# EAGLE schematic MA-DAQ (EAGLE 5.11)

## Sheet 1 of 5
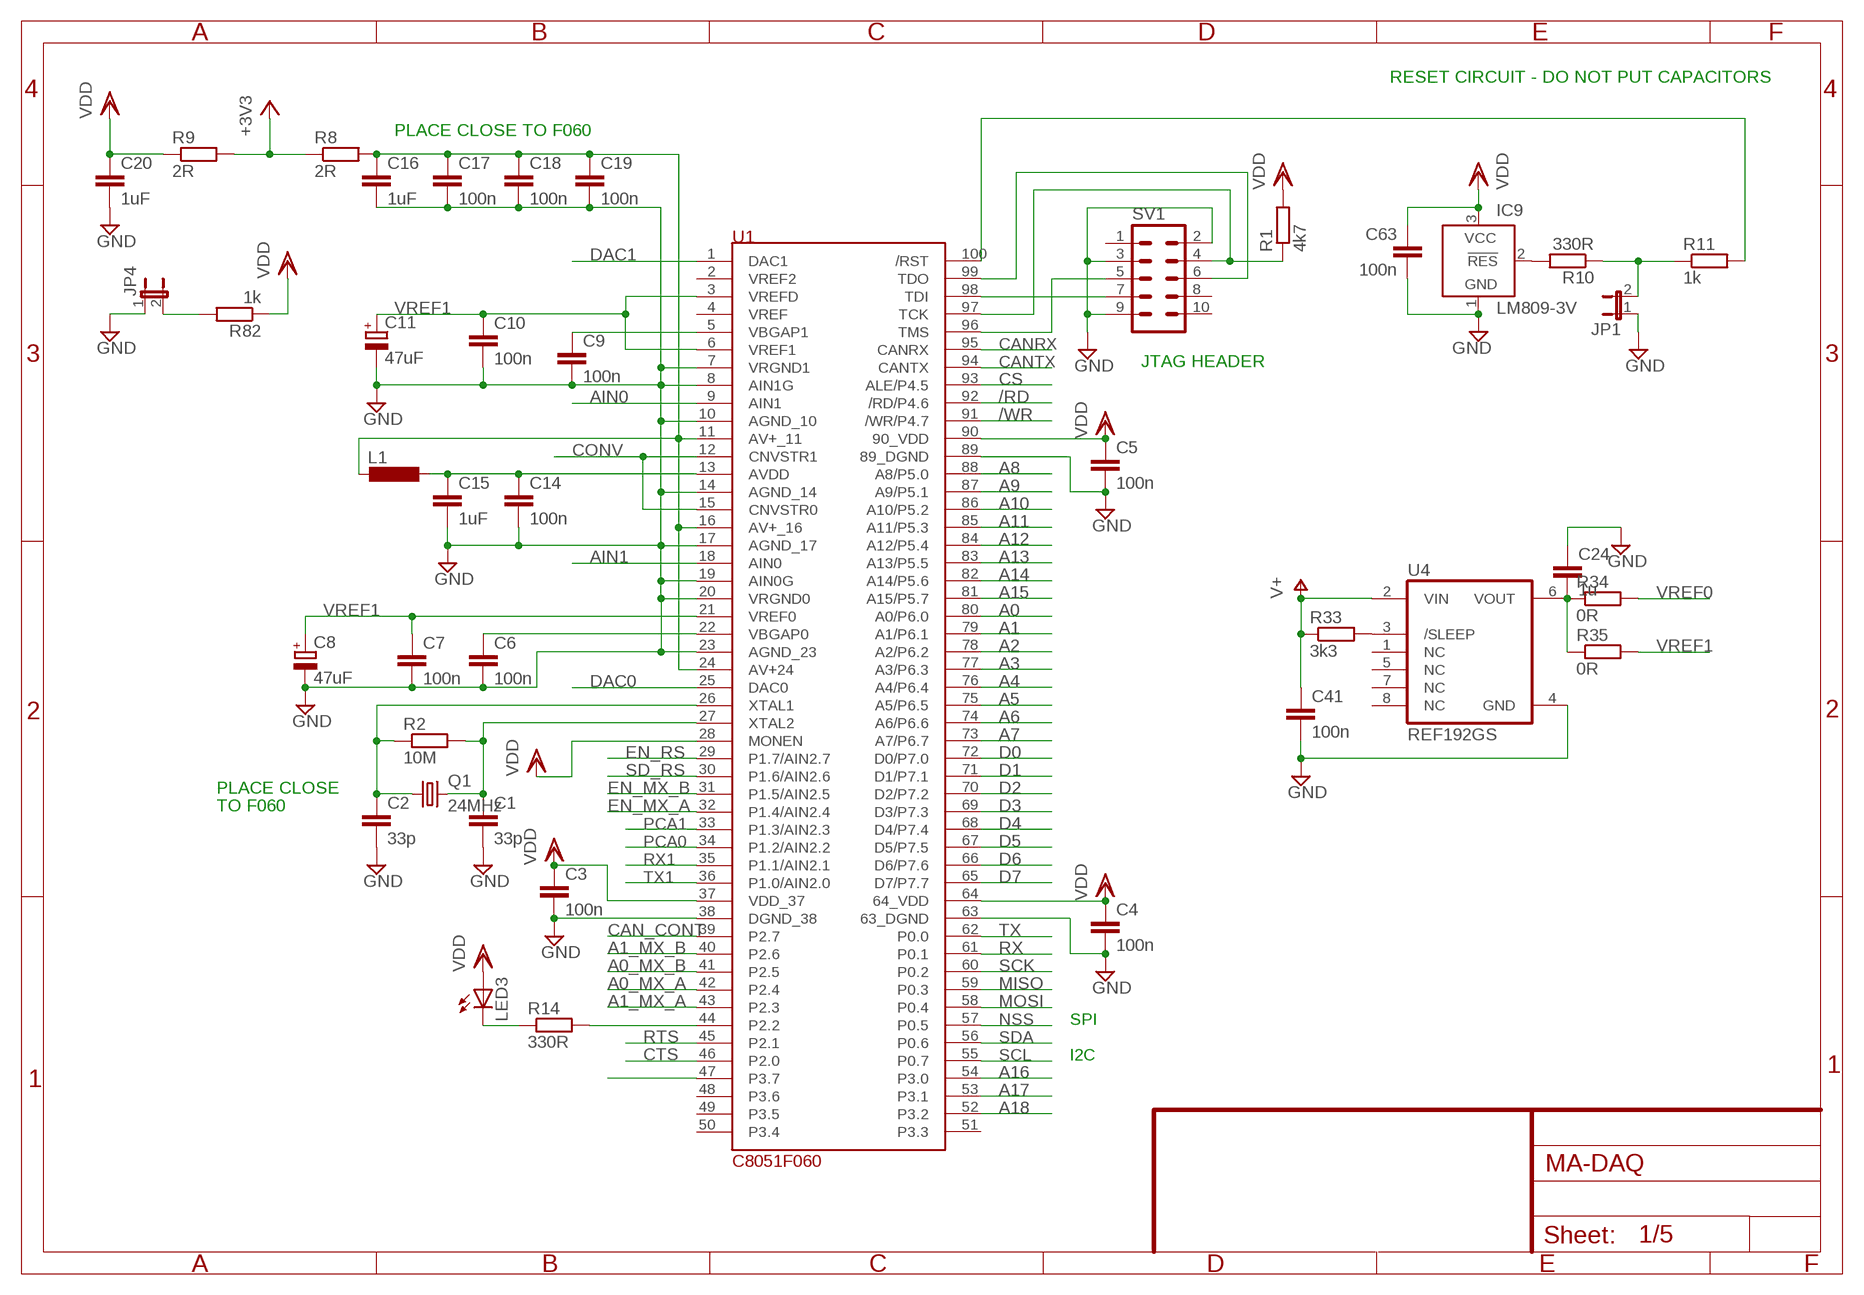
[diagram p0: schematic, sheet 1]

### Parts
C1  33p  C0805  [C0805]
C2  33p  C0805  [C0805]
C3  100n  C0805  [C0805]
C4  100n  C0805  [C0805]
C5  100n  C0805  [C0805]
C6  100n  C0603  [C0603]
C7  100n  C0805  [C0805]
C8  47uF  CPOL-EUCT6032  [CT6032]
C9  100n  C0603  [C0603]
C10  100n  C0805  [C0805]
C11  47uF  CPOL-EUCT6032  [CT6032]
C14  100n  C0805  [C0805]
C15  1uF  C0805  [C0805]
C16  1uF  C0805  [C0805]
C17  100n  C0603  [C0603]
C18  100n  C0603  [C0603]
C19  100n  C0603  [C0603]
C20  1uF  C0805  [C0805]
C24  1u  C0805  [C0805]
C41  100n  C0805  [C0805]
C63  100n  C0805  [C0805]
IC9  LM809-3V  MAX809  [SOT23B-3]
JP1  JP1E  [JP1]
JP4  JP1E  [JP1]
L1  L0805  [R0805]
LED3  LEDSMT1206  [1206]
Q1  24MHz  CRYTALHC49S  [HC49/S]
R1  4k7  R0805  [R0805]
R2  10M  R0805  [R0805]
R8  2R  R0805  [R0805]
R9  2R  R0805  [R0805]
R10  330R  R0805  [R0805]
R11  1k  R0805  [R0805]
R14  330R  R0805  [R0805]
R33  3k3  R0805  [R0805]
R34  0R  R0805  [R0805]
R35  0R  R0805  [R0805]
R82  1k  R0603  [R0603]
SV1  ML10  [ML10]
U1  C8051F060  [TQFP100]
U4  REF192GS  [SO8]

### Nets
+3V3: R8.1 R9.2 ; also sheet 2
/RD: U1.92(/RD/P4.6) ; also sheet 2
/WR: U1.91(/WR/P4.7) ; also sheet 2
A0: U1.80(A0/P6.0) ; also sheet 2
A0_MX_A: U1.42(P2.4) ; also sheet 4
A0_MX_B: U1.41(P2.5) ; also sheet 3
A1: U1.79(A1/P6.1) ; also sheet 2
A1_MX_A: U1.43(P2.3) ; also sheet 4
A1_MX_B: U1.40(P2.6) ; also sheet 3
A2: U1.78(A2/P6.2) ; also sheet 2
A3: U1.77(A3/P6.3) ; also sheet 2
A4: U1.76(A4/P6.4) ; also sheet 2
A5: U1.75(A5/P6.5) ; also sheet 2
A6: U1.74(A6/P6.6) ; also sheet 2
A7: U1.73(A7/P6.7) ; also sheet 2
A8: U1.88(A8/P5.0) ; also sheet 2
A9: U1.87(A9/P5.1) ; also sheet 2
A10: U1.86(A10/P5.2) ; also sheet 2
A11: U1.85(A11/P5.3) ; also sheet 2
A12: U1.84(A12/P5.4) ; also sheet 2
A13: U1.83(A13/P5.5) ; also sheet 2
A14: U1.82(A14/P5.6) ; also sheet 2
A15: U1.81(A15/P5.7) ; also sheet 2
A16: U1.54(P3.0) ; also sheet 2
A17: U1.53(P3.1) ; also sheet 2
A18: U1.52(P3.2) ; also sheet 2
AIN0: U1.9(AIN1) ; also sheet 3
AIN1: U1.18(AIN0) ; also sheet 4
CAN_CONT: U1.39(P2.7) ; also sheet 3
CANRX: U1.95(CANRX) ; also sheet 3
CANTX: U1.94(CANTX) ; also sheet 3
CONV: U1.12(CNVSTR1) U1.15(CNVSTR0) ; also sheet 2
CS: U1.93(ALE/P4.5) ; also sheet 2
CTS: U1.46(P2.0) ; also sheet 5
D0: U1.72(D0/P7.0) ; also sheet 2
D1: U1.71(D1/P7.1) ; also sheet 2
D2: U1.70(D2/P7.2) ; also sheet 2
D3: U1.69(D3/P7.3) ; also sheet 2
D4: U1.68(D4/P7.4) ; also sheet 2
D5: U1.67(D5/P7.5) ; also sheet 2
D6: U1.66(D6/P7.6) ; also sheet 2
D7: U1.65(D7/P7.7) ; also sheet 2
DAC0: U1.25(DAC0) ; also sheet 3
DAC1: U1.1(DAC1) ; also sheet 3
EN_MX_A: U1.32(P1.4/AIN2.4) ; also sheet 4
EN_MX_B: U1.31(P1.5/AIN2.5) ; also sheet 3
EN_RS: U1.29(P1.7/AIN2.7)
GND: C1.1 C2.1 C3.1 C4.1 C5.1 C6.1 C7.1 C8.- C9.1 C10.1 C11.- C14.1 C15.1 C16.1 C17.1 C18.1 C19.1 C20.1 C24.2 C41.1 C63.1 IC9.1(GND) JP1.1 JP4.1 SV1.2 SV1.3 SV1.9 U1.7(VRGND1) U1.8(AIN1G) U1.10(AGND_10) U1.14(AGND_14) U1.17(AGND_17) U1.19(AIN0G) U1.20(VRGND0) U1.23(AGND_23) U1.38(DGND_38) U1.63(63_DGND) U1.89(89_DGND) U4.4(GND) ; also sheet 2,3,4,5
MISO: U1.59(P0.3) ; also sheet 2
MOSI: U1.58(P0.4) ; also sheet 2
N$1: SV1.7 U1.98(TDI)
N$2: SV1.5 U1.96(TMS)
N$3: R1.1 SV1.4 U1.97(TCK)
N$4: SV1.6 U1.99(TDO)
N$5: C1.2 Q1.2 R2.2 U1.27(XTAL2)
N$6: C2.2 Q1.1 R2.1 U1.26(XTAL1)
N$8: C6.2 U1.22(VBGAP0)
N$12: C9.2 U1.5(VBGAP1)
N$15: C14.2 C15.2 L1.2 U1.13(AVDD)
N$16: JP1.2 R10.1 R11.1
N$17: R11.2 U1.100(/RST)
N$19: C16.2 C17.2 C18.2 C19.2 L1.1 R8.2 U1.11(AV+_11) U1.16(AV+_16) U1.24(AV+24)
N$23: LED3.C R14.1
N$26: R14.2 U1.44(P2.2)
N$46: R33.2 U4.3(/SLEEP)
N$49: C24.1 R34.1 R35.1 U4.6(VOUT)
N$65: IC9.2(!RES) R10.2
N$103: JP4.2 R82.2
N$108: U1.47(P3.7)
NSS: U1.57(P0.5) ; also sheet 2
PCA0: U1.34(P1.2/AIN2.2) ; also sheet 2
PCA1: U1.33(P1.3/AIN2.3) ; also sheet 2
RTS: U1.45(P2.1) ; also sheet 5
RX: U1.61(P0.1) ; also sheet 5
RX1: U1.35(P1.1/AIN2.1) ; also sheet 2
SCK: U1.60(P0.2) ; also sheet 2
SCL: U1.55(P0.7) ; also sheet 2
SD_RS: U1.30(P1.6/AIN2.6)
SDA: U1.56(P0.6) ; also sheet 2
TX: U1.62(P0.0) ; also sheet 5
TX1: U1.36(P1.0/AIN2.0) ; also sheet 2
V+: C41.2 R33.1 U4.2(VIN) ; also sheet 2,3,4
VDD: C3.2 C4.2 C5.2 C20.2 C63.2 IC9.3(VCC) LED3.A R1.2 R9.1 R82.1 U1.28(MONEN) U1.37(VDD_37) U1.64(64_VDD) U1.90(90_VDD) ; also sheet 2,3,5
VREF0: R34.2 ; also sheet 3,4
VREF1: C7.2 C8.+ C10.2 C11.+ R35.2 U1.3(VREFD) U1.6(VREF1) U1.21(VREF0)
Unconnected: SV1.1 SV1.8 SV1.10 U1.2(VREF2) U1.4(VREF) U1.48(P3.6) U1.49(P3.5) U1.50(P3.4) U1.51(P3.3) U4.1(NC) U4.5(NC) U4.7(NC) U4.8(NC)

### Notes on the sheet
- RESET CIRCUIT - DO NOT PUT CAPACITORS
- PLACE CLOSE TO F060
- JTAG HEADER
- PLACE CLOSE
- TO F060
- SPI
- I2C

## Sheet 2 of 5
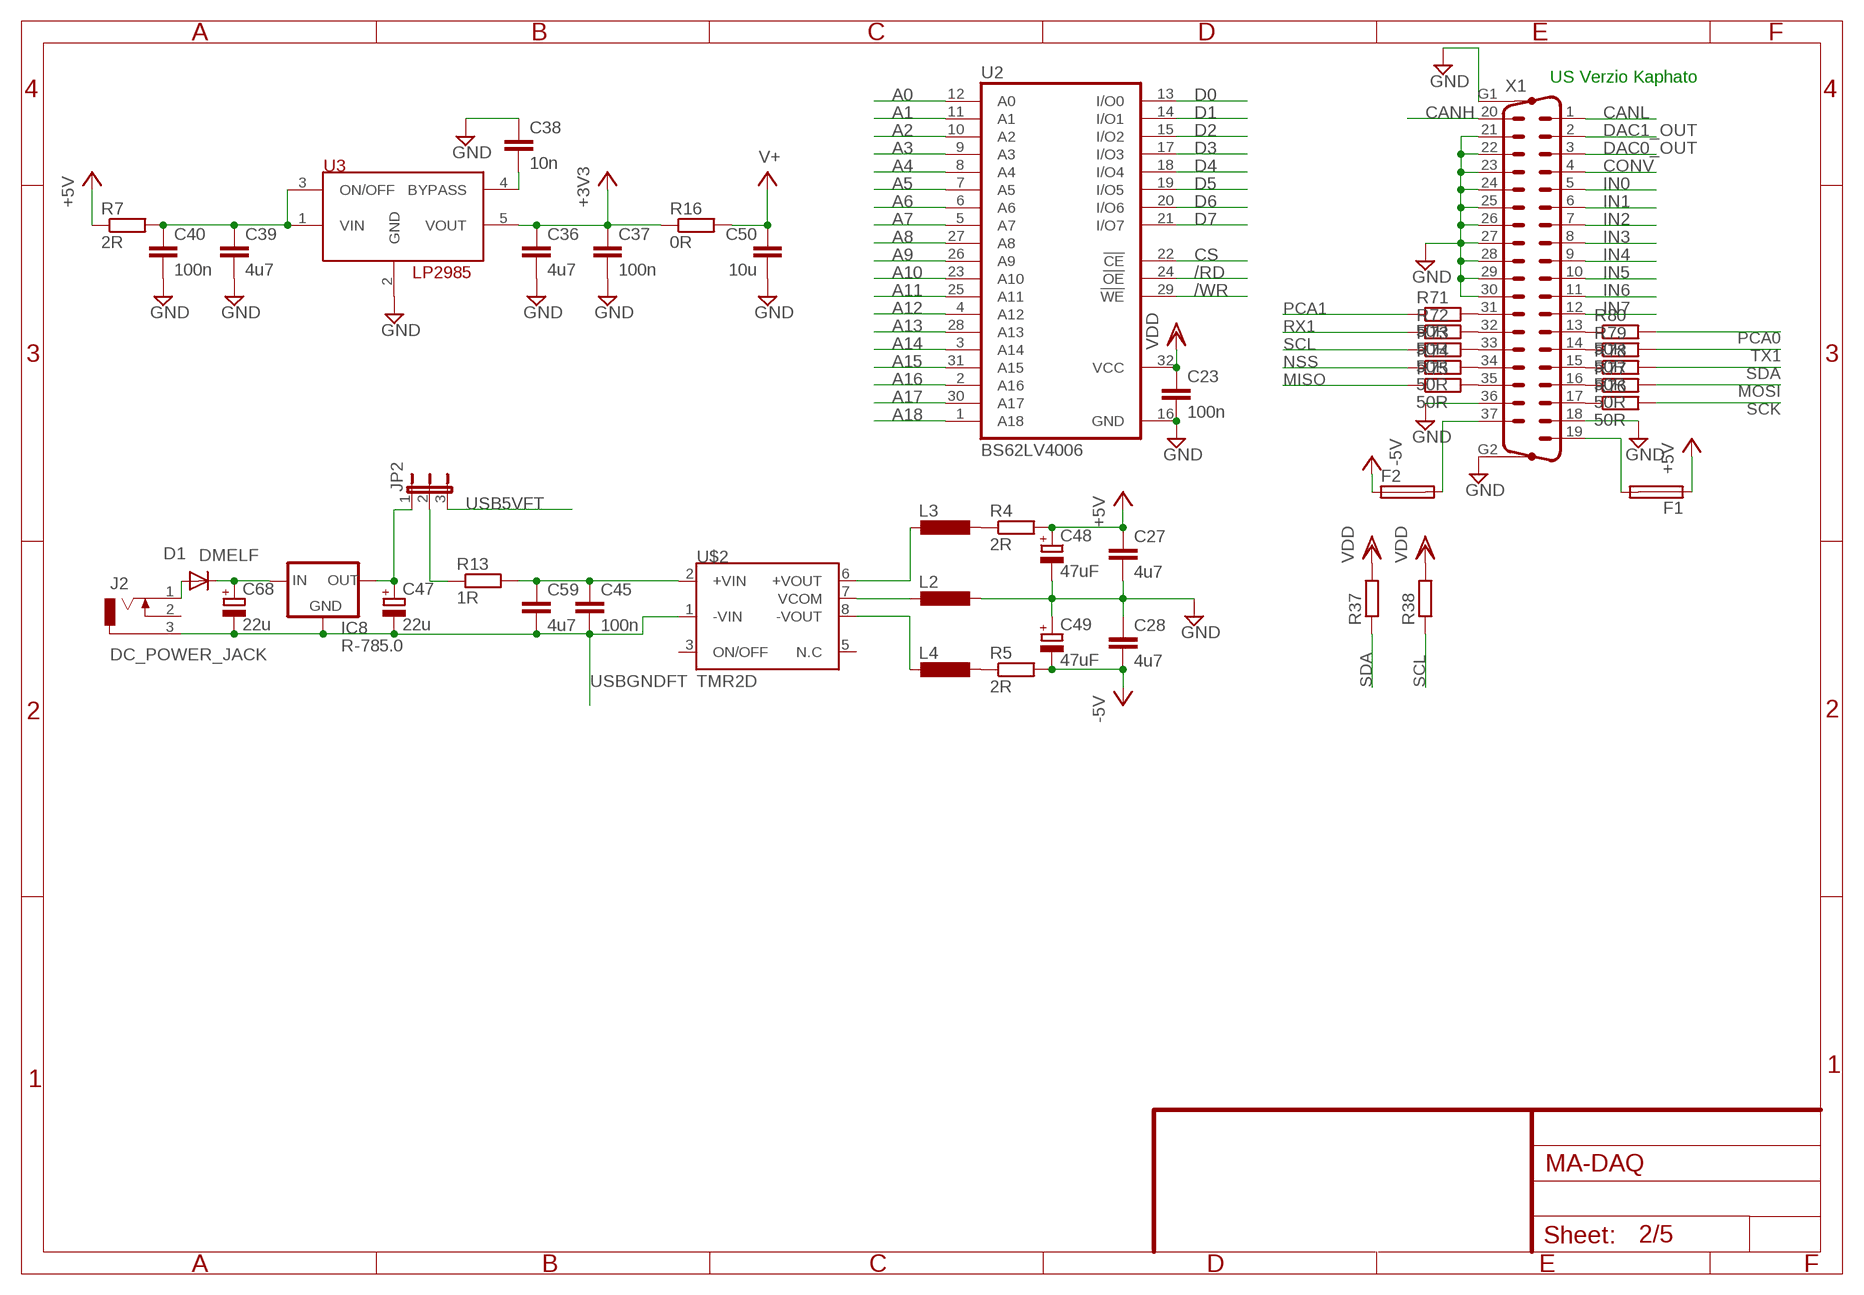
[diagram p1: schematic, sheet 2]

### Parts
C23  100n  C0805  [C0805]
C27  4u7  C0805  [C0805]
C28  4u7  C0805  [C0805]
C36  4u7  C0805  [C0805]
C37  100n  C0805  [C0805]
C38  10n  C0805  [C0805]
C39  4u7  C0805  [C0805]
C40  100n  C0805  [C0805]
C45  100n  C0805  [C0805]
C47  22u  CPOL-EUCT6032  [CT6032]
C48  47uF  CPOL-EUCT6032  [CT6032]
C49  47uF  CPOL-EUCT6032  [CT6032]
C50  10u  C0805  [C0805]
C59  4u7  C0805  [C0805]
C68  22u  CPOL-EUE2.5-6  [E2,5-6]
D1  DMELF  [MELF-MLL41]
F1  TE5  [TE5]
F2  TE5  [TE5]
IC8  R-785.0  R-78XX-0.5  [R-78XX-0.5]
J2  DC_POWER_JACK  [DC_POWER_JACK]
JP2  JP2E  [JP2]
L2  L1812  [L1812]
L3  L1812  [L1812]
L4  L1812  [L1812]
R4  2R  R0805  [R0805]
R5  2R  R0805  [R0805]
R7  2R  R0805  [R0805]
R13  1R  R10  [0207/10]
R16  0R  R0805  [R0805]
R37  R0805  [R0805]
R38  R0805  [R0805]
R71  50R  R0805  [R0805]
R72  50R  R0805  [R0805]
R73  50R  R0805  [R0805]
R74  50R  R0805  [R0805]
R75  50R  R0805  [R0805]
R76  50R  R0805  [R0805]
R77  50R  R0805  [R0805]
R78  50R  R0805  [R0805]
R79  50R  R0805  [R0805]
R80  50R  R0805  [R0805]
U2  BS62LV4006  [SOP32]
U3  LP2985  [SOT23-5L]
U$2  TMR2D  [TMR2P]
X1  M37HP  [M37HP]

### Nets
+3V3: C36.2 C37.2 R16.1 U3.5(VOUT) ; also sheet 1
+5V: C27.2 C48.+ F1.1 R4.2 R7.1 ; also sheet 3,4
-5V: C28.1 C49.- F2.1 R5.2 ; also sheet 3,4
/RD: U2.24(!OE) ; also sheet 1
/WR: U2.29(!WE) ; also sheet 1
A0: U2.12(A0) ; also sheet 1
A1: U2.11(A1) ; also sheet 1
A2: U2.10(A2) ; also sheet 1
A3: U2.9(A3) ; also sheet 1
A4: U2.8(A4) ; also sheet 1
A5: U2.7(A5) ; also sheet 1
A6: U2.6(A6) ; also sheet 1
A7: U2.5(A7) ; also sheet 1
A8: U2.27(A8) ; also sheet 1
A9: U2.26(A9) ; also sheet 1
A10: U2.23(A10) ; also sheet 1
A11: U2.25(A11) ; also sheet 1
A12: U2.4(A12) ; also sheet 1
A13: U2.28(A13) ; also sheet 1
A14: U2.3(A14) ; also sheet 1
A15: U2.31(A15) ; also sheet 1
A16: U2.2(A16) ; also sheet 1
A17: U2.30(A17) ; also sheet 1
A18: U2.1(A18) ; also sheet 1
CANH: X1.20 ; also sheet 3
CANL: X1.1 ; also sheet 3
CONV: X1.4 ; also sheet 1
CS: U2.22(!CE) ; also sheet 1
D0: U2.13(I/O0) ; also sheet 1
D1: U2.14(I/O1) ; also sheet 1
D2: U2.15(I/O2) ; also sheet 1
D3: U2.17(I/O3) ; also sheet 1
D4: U2.18(I/O4) ; also sheet 1
D5: U2.19(I/O5) ; also sheet 1
D6: U2.20(I/O6) ; also sheet 1
D7: U2.21(I/O7) ; also sheet 1
DAC0_OUT: X1.3 ; also sheet 3
DAC1_OUT: X1.2 ; also sheet 3
GND: C23.1 C27.1 C28.2 C36.1 C37.1 C38.2 C39.1 C40.1 C48.- C49.+ C50.1 L2.2 U2.16(GND) U3.2(GND) X1.18 X1.21 X1.22 X1.23 X1.24 X1.25 X1.26 X1.27 X1.28 X1.29 X1.30 X1.36 X1.G1 X1.G2 ; also sheet 1,3,4,5
IN0: X1.5 ; also sheet 3
IN1: X1.6 ; also sheet 3
IN2: X1.7 ; also sheet 3
IN3: X1.8 ; also sheet 3
IN4: X1.9 ; also sheet 4
IN5: X1.10 ; also sheet 4
IN6: X1.11 ; also sheet 4
IN7: X1.12 ; also sheet 4
MISO: R75.1 ; also sheet 1
MOSI: R77.2 ; also sheet 1
N$14: C38.1 U3.4(BYPASS)
N$22: L2.1 U$2.7(VCOM)
N$30: D1.A J2.1
N$31: L4.2 R5.1
N$37: F2.2 X1.37
N$39: R77.1 X1.16
N$43: R78.1 X1.15
N$45: C39.2 C40.2 R7.2 U3.1(VIN) U3.3(ON/OFF)
N$47: R72.2 X1.32
N$50: R73.2 X1.33
N$51: R71.2 X1.31
N$54: C68.+ D1.C IC8.IN
N$55: L3.2 R4.1
N$56: C45.2 C59.2 R13.2 U$2.2(+VIN)
N$57: C47.+ IC8.OUT JP2.1
N$58: JP2.2 R13.1
N$59: L3.1 U$2.6(+VOUT)
N$60: L4.1 U$2.8(-VOUT)
N$62: F1.2 X1.19
N$82: R74.2 X1.34
N$96: R75.2 X1.35
N$97: R76.1 X1.17
N$99: R79.1 X1.14
N$101: R80.1 X1.13
NSS: R74.1 ; also sheet 1
PCA0: R80.2 ; also sheet 1
PCA1: R71.1 ; also sheet 1
RX1: R72.1 ; also sheet 1
SCK: R76.2 ; also sheet 1
SCL: R38.1 R73.1 ; also sheet 1
SDA: R37.1 R78.2 ; also sheet 1
TX1: R79.2 ; also sheet 1
USB5VFT: JP2.3 ; also sheet 4,5
USBGNDFT: C45.1 C47.- C59.1 C68.- IC8.GND J2.3 U$2.1(-VIN) ; also sheet 4,5
V+: C50.2 R16.2 ; also sheet 1,3,4
VDD: C23.2 R37.2 R38.2 U2.32(VCC) ; also sheet 1,3,5
Unconnected: J2.2 U$2.5(N.C)

### Notes on the sheet
- US Verzio Kaphato

## Sheet 3 of 5
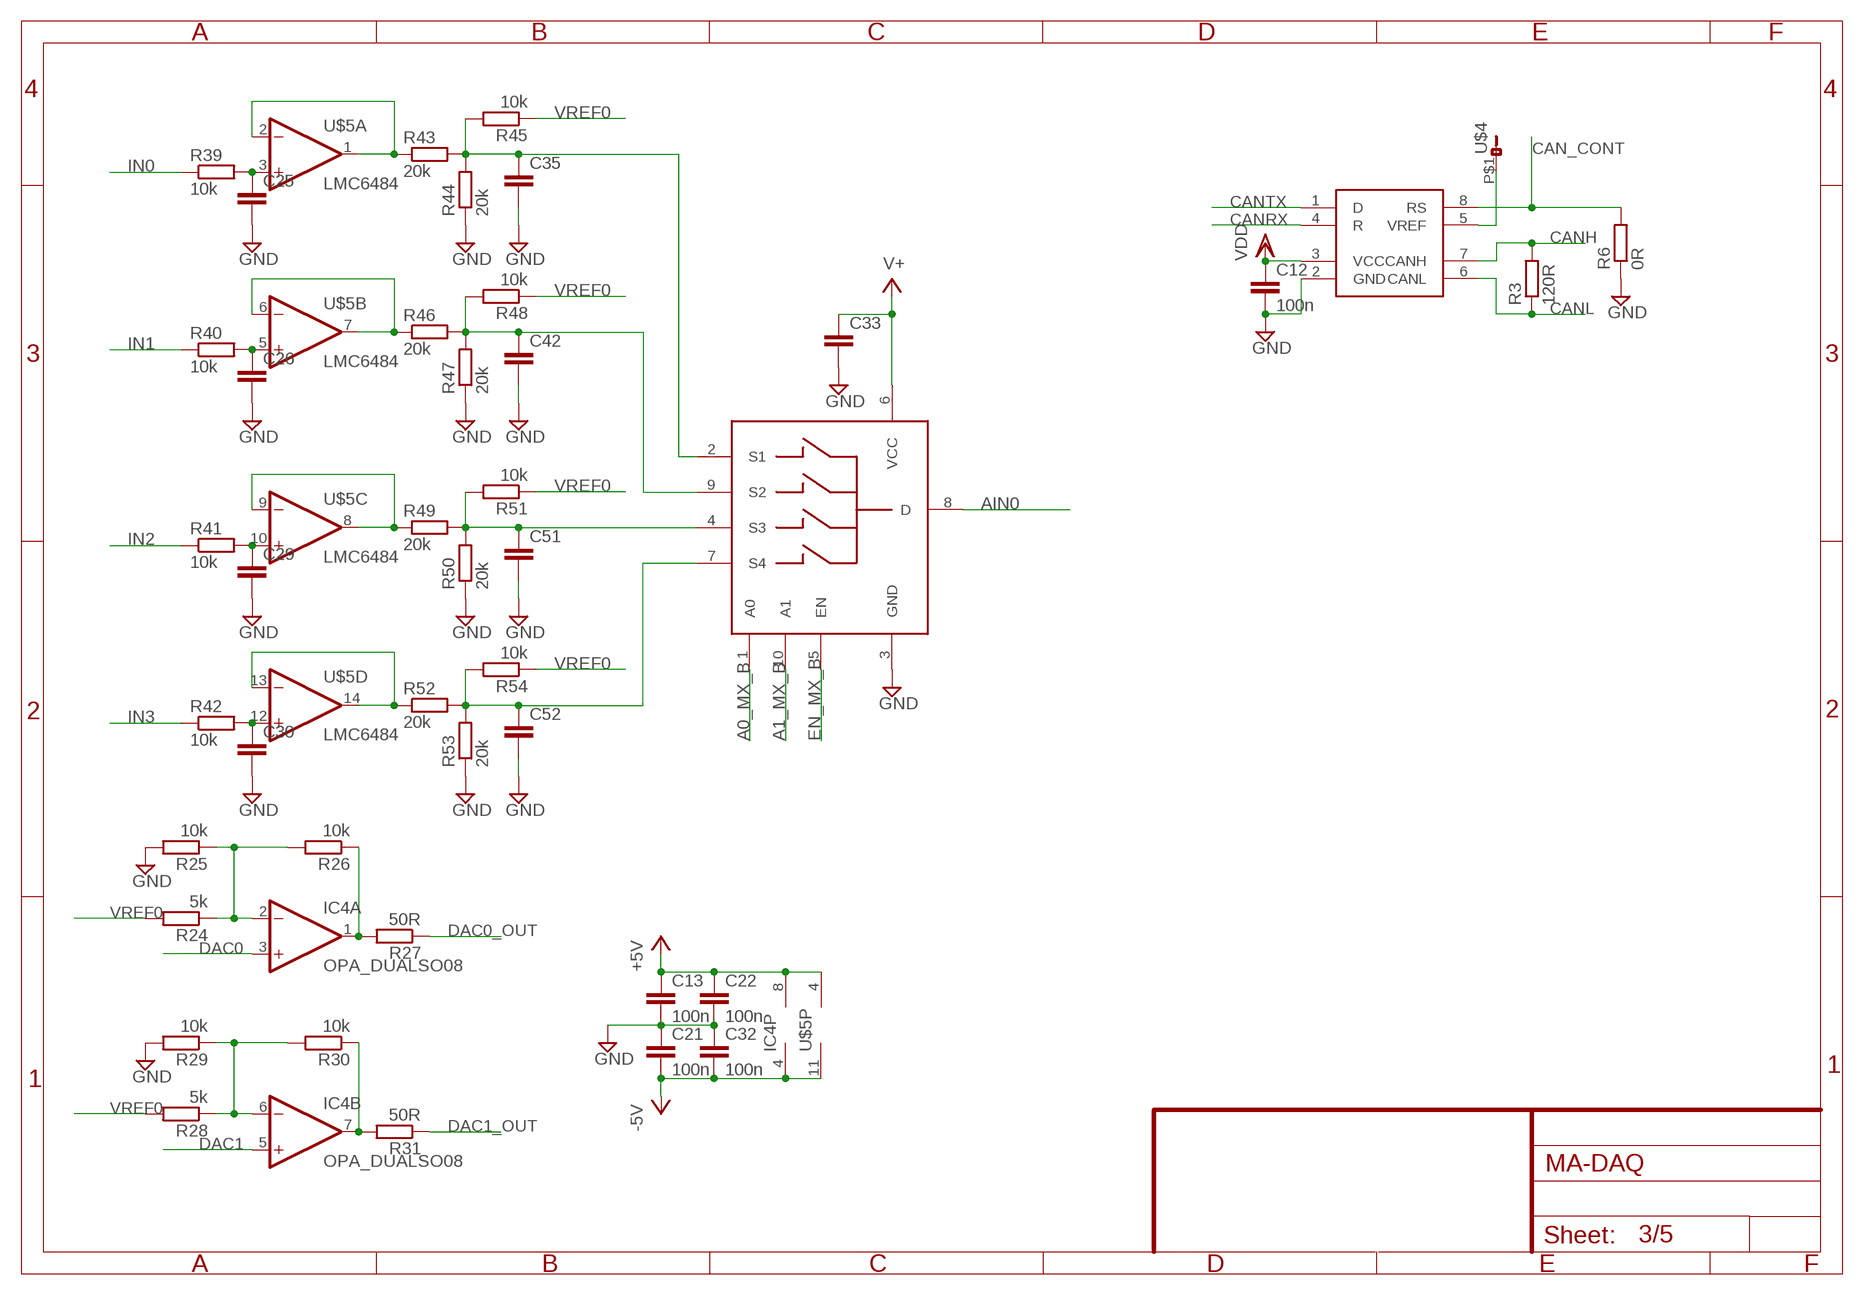
[diagram p2: schematic, sheet 3]

### Parts
C12  100n  C0805  [C0805]
C13  100n  C0805  [C0805]
C21  100n  C0805  [C0805]
C22  100n  C0805  [C0805]
C25  C0805  [C0805]
C26  C0805  [C0805]
C29  C0805  [C0805]
C30  C0805  [C0805]
C32  100n  C0805  [C0805]
C33  C0805  [C0805]
C35  C0805  [C0805]
C42  C0805  [C0805]
C51  C0805  [C0805]
C52  C0805  [C0805]
IC4  OPA_DUALSO08  [SO08]
IC5  ADG704  [MSOP10]
R3  120R  R0805  [R0805]
R6  0R  R0805  [R0805]
R24  5k  R1206  [R1206]
R25  10k  R0805  [R0805]
R26  10k  R0805  [R0805]
R27  50R  R0805  [R0805]
R28  5k  R0805  [R0805]
R29  10k  R0805  [R0805]
R30  10k  R0805  [R0805]
R31  50R  R0805  [R0805]
R39  10k  R0805  [R0805]
R40  10k  R0805  [R0805]
R41  10k  R0805  [R0805]
R42  10k  R0805  [R0805]
R43  20k  R0805  [R0805]
R44  20k  R0805  [R0805]
R45  10k  R0805  [R0805]
R46  20k  R0805  [R0805]
R47  20k  R0805  [R0805]
R48  10k  R0805  [R0805]
R49  20k  R0805  [R0805]
R50  20k  R0805  [R0805]
R51  10k  R0805  [R0805]
R52  20k  R0805  [R0805]
R53  20k  R0805  [R0805]
R54  10k  R0805  [R0805]
U$3  SN65HVD230  [SO08]
U$4  PAD_CONNECT_3  [PAD_CONNECT_3]
U$5  LMC6484  OPA_QUADSO14  [SO14]

### Nets
+5V: C13.2 C22.2 IC4.8(P:V+) U$5.4(P:V+) ; also sheet 2,4
-5V: C21.1 C32.1 IC4.4(P:V-) U$5.11(P:V-) ; also sheet 2,4
A0_MX_B: IC5.1(A0) ; also sheet 1
A1_MX_B: IC5.10(A1) ; also sheet 1
AIN0: IC5.8(D) ; also sheet 1
CAN_CONT: R6.2 U$3.8(RS) ; also sheet 1
CANH: R3.2 U$3.7(CANH) ; also sheet 2
CANL: R3.1 U$3.6(CANL) ; also sheet 2
CANRX: U$3.4(R) ; also sheet 1
CANTX: U$3.1(D) ; also sheet 1
DAC0: IC4.3(A:+IN) ; also sheet 1
DAC0_OUT: R27.1 ; also sheet 2
DAC1: IC4.5(B:+IN) ; also sheet 1
DAC1_OUT: R31.1 ; also sheet 2
EN_MX_B: IC5.5(EN) ; also sheet 1
GND: C12.1 C13.1 C21.2 C22.1 C25.1 C26.1 C29.1 C30.1 C32.2 C33.1 C35.1 C42.1 C51.1 C52.1 IC5.3(GND) R6.1 R25.2 R29.2 R44.1 R47.1 R50.1 R53.1 U$3.2(GND) ; also sheet 1,2,4,5
IN0: R39.1 ; also sheet 2
IN1: R40.1 ; also sheet 2
IN2: R41.1 ; also sheet 2
IN3: R42.1 ; also sheet 2
N$9: U$3.5(VREF) U$4.P$1
N$21: IC4.2(A:-IN) R24.1 R25.1 R26.2
N$24: IC4.1(A:OUT) R26.1 R27.2
N$25: IC4.6(B:-IN) R28.1 R29.1 R30.2
N$35: IC4.7(B:OUT) R30.1 R31.2
N$52: R43.1 U$5.1(A:OUT) U$5.2(A:-IN)
N$53: R46.1 U$5.6(B:-IN) U$5.7(B:OUT)
N$61: R49.1 U$5.8(C:OUT) U$5.9(C:-IN)
N$63: R52.1 U$5.13(D:-IN) U$5.14(D:OUT)
N$64: C25.2 R39.2 U$5.3(A:+IN)
N$66: C26.2 R40.2 U$5.5(B:+IN)
N$67: C29.2 R41.2 U$5.10(C:+IN)
N$68: C30.2 R42.2 U$5.12(D:+IN)
N$74: C35.2 IC5.2(S1) R43.2 R44.2 R45.2
N$75: C42.2 IC5.9(S2) R46.2 R47.2 R48.2
N$77: C51.2 IC5.4(S3) R49.2 R50.2 R51.2
N$78: C52.2 IC5.7(S4) R52.2 R53.2 R54.2
V+: C33.2 IC5.6(VCC) ; also sheet 1,2,4
VDD: C12.2 U$3.3(VCC) ; also sheet 1,2,5
VREF0: R24.2 R28.2 R45.1 R48.1 R51.1 R54.1 ; also sheet 1,4

## Sheet 4 of 5
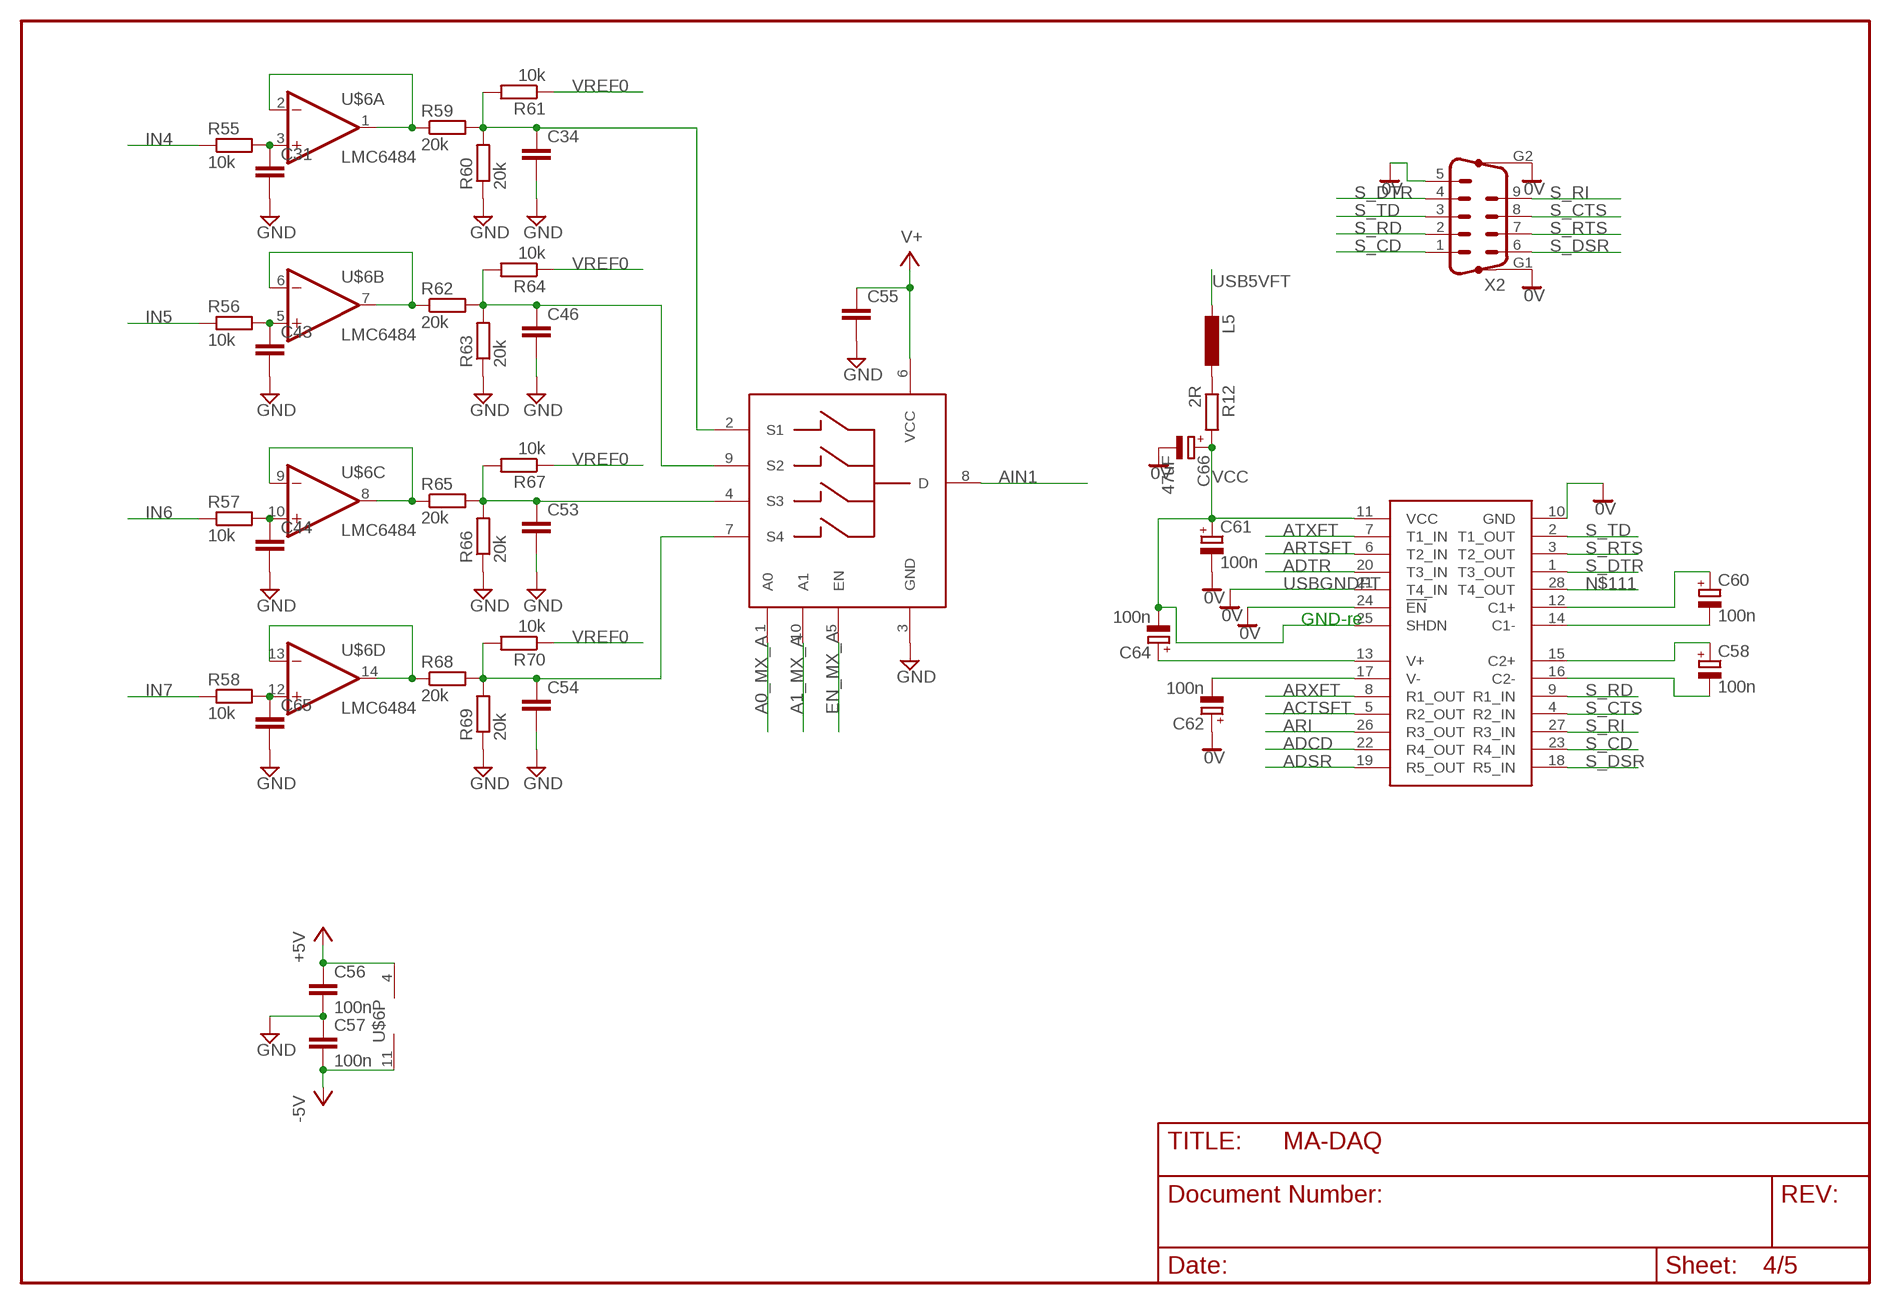
[diagram p3: schematic, sheet 4]

### Parts
C31  C0805  [C0805]
C34  C0805  [C0805]
C43  C0805  [C0805]
C44  C0805  [C0805]
C46  C0805  [C0805]
C53  C0805  [C0805]
C54  C0805  [C0805]
C55  C0805  [C0805]
C56  100n  C0805  [C0805]
C57  100n  C0805  [C0805]
C58  100n  CPOL-EUSMCA  [SMC_A]
C60  100n  CPOL-EUSMCA  [SMC_A]
C61  100n  CPOL-EUSMCA  [SMC_A]
C62  100n  CPOL-EUSMCA  [SMC_A]
C64  100n  CPOL-EUSMCA  [SMC_A]
C65  C0805  [C0805]
C66  47uF  CPOL-EUCT6032  [CT6032]
IC6  ADG704  [MSOP10]
L5  L1812  [L1812]
R12  2R  R0805  [R0805]
R55  10k  R0805  [R0805]
R56  10k  R0805  [R0805]
R57  10k  R0805  [R0805]
R58  10k  R0805  [R0805]
R59  20k  R0805  [R0805]
R60  20k  R0805  [R0805]
R61  10k  R0805  [R0805]
R62  20k  R0805  [R0805]
R63  20k  R0805  [R0805]
R64  10k  R0805  [R0805]
R65  20k  R0805  [R0805]
R66  20k  R0805  [R0805]
R67  10k  R0805  [R0805]
R68  20k  R0805  [R0805]
R69  20k  R0805  [R0805]
R70  10k  R0805  [R0805]
U$1  ADM211  [TSSOP28]
U$6  LMC6484  OPA_QUADSO14  [SO14]
X2  M09HP  [M09HP]

### Nets
+5V: C56.2 U$6.4(P:V+) ; also sheet 2,3
-5V: C57.1 U$6.11(P:V-) ; also sheet 2,3
A0_MX_A: IC6.1(A0) ; also sheet 1
A1_MX_A: IC6.10(A1) ; also sheet 1
ACTSFT: U$1.5(R2_OUT) ; also sheet 5
ADCD: U$1.22(R4_OUT) ; also sheet 5
ADSR: U$1.19(R5_OUT) ; also sheet 5
ADTR: U$1.20(T3_IN) ; also sheet 5
AIN1: IC6.8(D) ; also sheet 1
ARI: U$1.26(R3_OUT) ; also sheet 5
ARTSFT: U$1.6(T2_IN) ; also sheet 5
ARXFT: U$1.8(R1_OUT) ; also sheet 5
ATXFT: U$1.7(T1_IN) ; also sheet 5
EN_MX_A: IC6.5(EN) ; also sheet 1
GND: C31.1 C34.1 C43.1 C44.1 C46.1 C53.1 C54.1 C55.1 C56.1 C57.2 C65.1 IC6.3(GND) R60.1 R63.1 R66.1 R69.1 ; also sheet 1,2,3,5
IN4: R55.1 ; also sheet 2
IN5: R56.1 ; also sheet 2
IN6: R57.1 ; also sheet 2
IN7: R58.1 ; also sheet 2
N$32: C58.- U$1.16(C2-)
N$33: C58.+ U$1.15(C2+)
N$34: C60.- U$1.14(C1-)
N$36: C60.+ U$1.12(C1+)
N$38: C62.- U$1.17(V-)
N$40: C64.+ U$1.13(V+)
N$41: L5.2 R12.1
N$84: R59.1 U$6.1(A:OUT) U$6.2(A:-IN)
N$85: R62.1 U$6.6(B:-IN) U$6.7(B:OUT)
N$86: R65.1 U$6.8(C:OUT) U$6.9(C:-IN)
N$87: R68.1 U$6.13(D:-IN) U$6.14(D:OUT)
N$88: C31.2 R55.2 U$6.3(A:+IN)
N$89: C43.2 R56.2 U$6.5(B:+IN)
N$90: C44.2 R57.2 U$6.10(C:+IN)
N$91: C65.2 R58.2 U$6.12(D:+IN)
N$92: C34.2 IC6.2(S1) R59.2 R60.2 R61.2
N$93: C46.2 IC6.9(S2) R62.2 R63.2 R64.2
N$94: C53.2 IC6.4(S3) R65.2 R66.2 R67.2
N$95: C54.2 IC6.7(S4) R68.2 R69.2 R70.2
N$111: U$1.28(T4_OUT)
S_CD: U$1.23(R4_IN) X2.1
S_CTS: U$1.4(R2_IN) X2.8
S_DSR: U$1.18(R5_IN) X2.6
S_DTR: U$1.1(T3_OUT) X2.4
S_RD: U$1.9(R1_IN) X2.2
S_RI: U$1.27(R3_IN) X2.9
S_RTS: U$1.3(T2_OUT) X2.7
S_TD: U$1.2(T1_OUT) X2.3
USB5VFT: L5.1 ; also sheet 2,5
USBGNDFT: C61.- C62.+ C66.- U$1.10(GND) U$1.21(T4_IN) U$1.24(!EN) X2.5 X2.G1 X2.G2 ; supply symbol labelled 0V ; also sheet 2,5
V+: C55.2 IC6.6(VCC) ; also sheet 1,2,3
VCC: C61.+ C64.- C66.+ R12.2 U$1.11(VCC) U$1.25(SHDN)
VREF0: R61.1 R64.1 R67.1 R70.1 ; also sheet 1,3

### Notes on the sheet
- GND-re

## Sheet 5 of 5
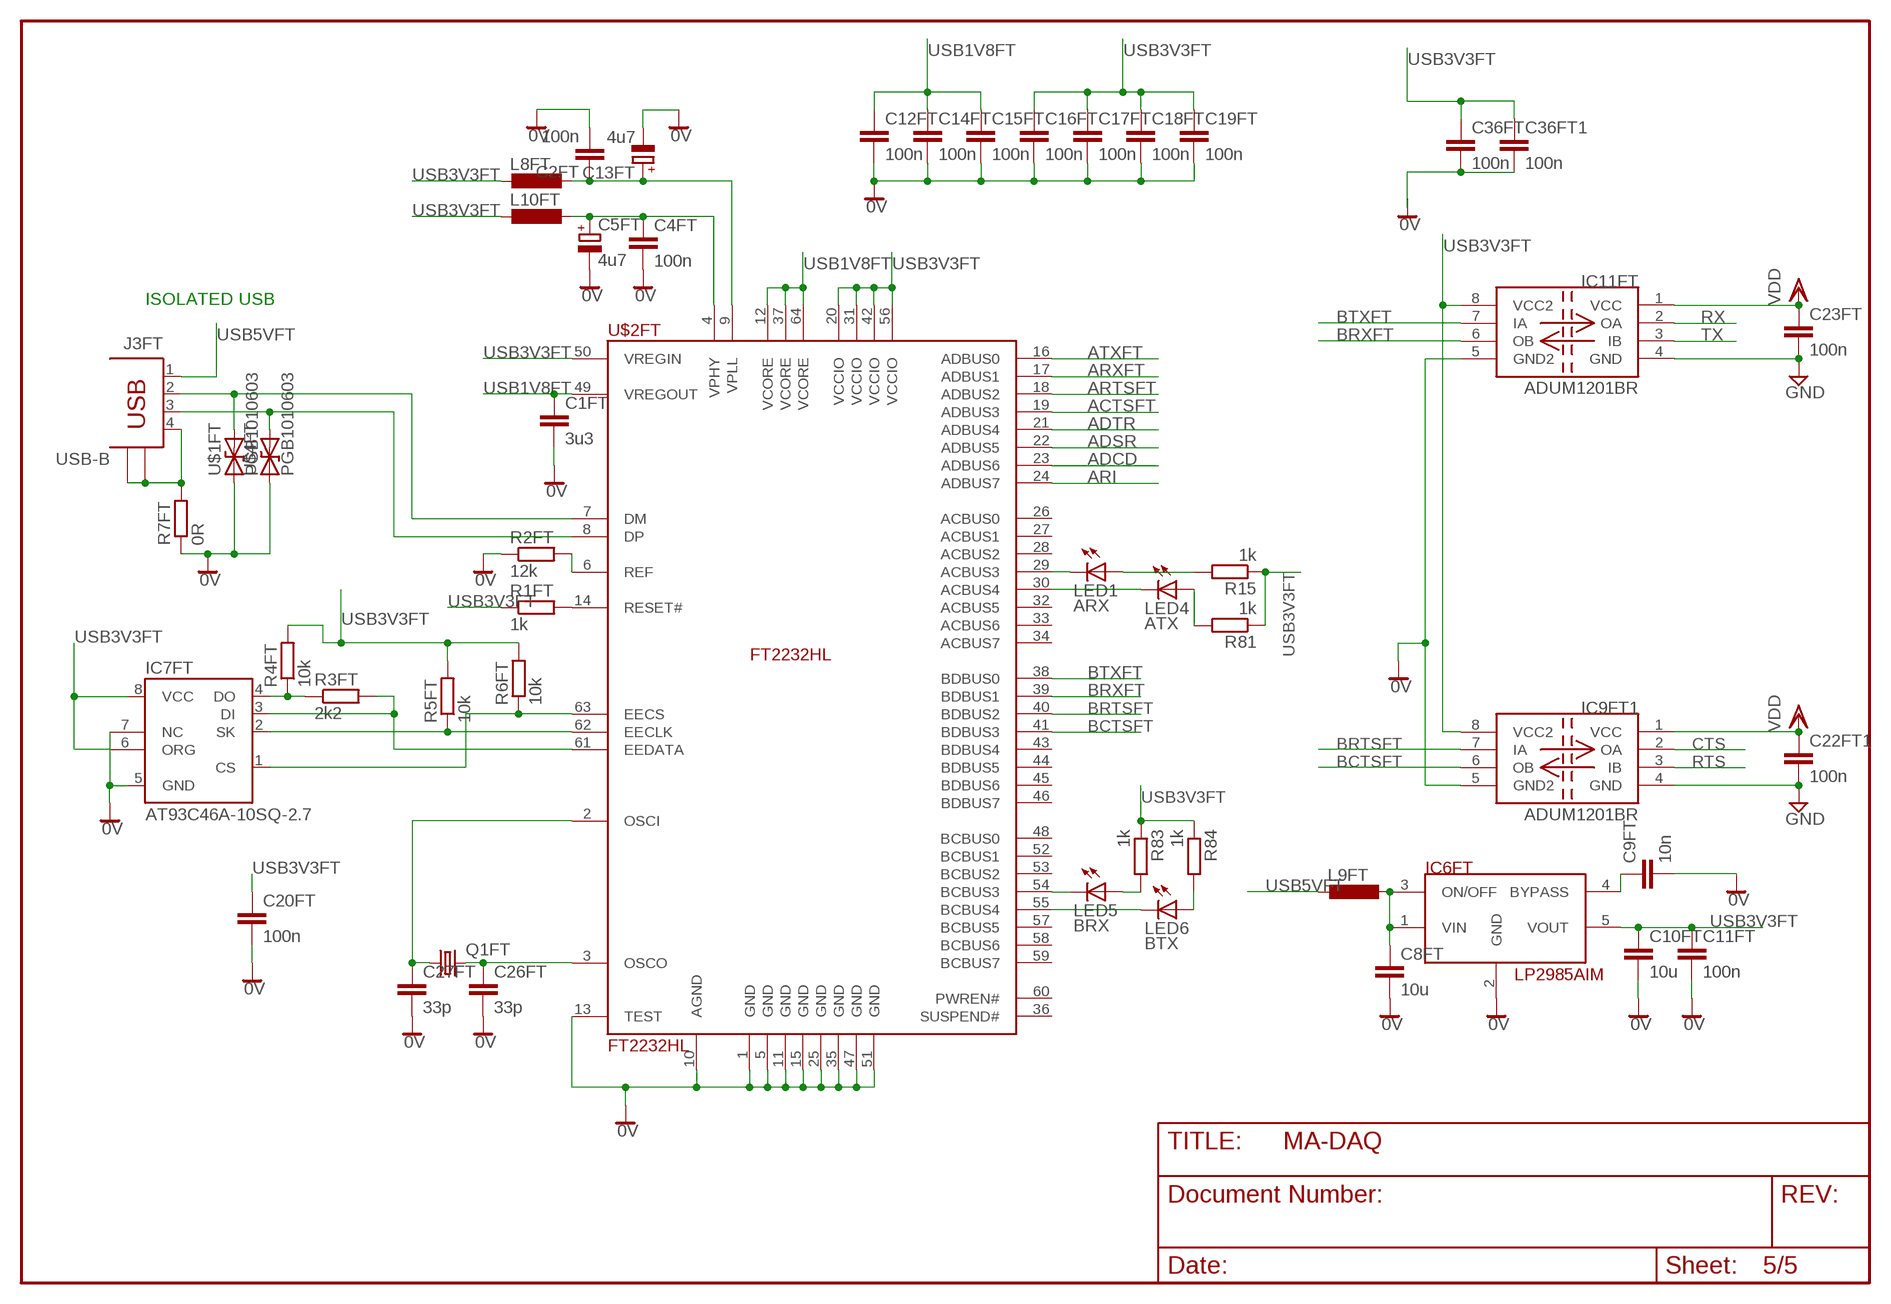
[diagram p4: schematic, sheet 5]

### Parts
C1FT  3u3  C0805  [C0805]
C2FT  100n  C0603  [C0603]
C4FT  100n  C0603  [C0603]
C5FT  4u7  CPOL-EUCT3528  [CT3528]
C8FT  10u  C0805  [C0805]
C9FT  10n  C0603  [C0603]
C10FT  10u  C0805  [C0805]
C11FT  100n  C0603  [C0603]
C12FT  100n  C0603  [C0603]
C13FT  4u7  CPOL-EUCT3528  [CT3528]
C14FT  100n  C0603  [C0603]
C15FT  100n  C0603  [C0603]
C16FT  100n  C0603  [C0603]
C17FT  100n  C0603  [C0603]
C18FT  100n  C0603  [C0603]
C19FT  100n  C0603  [C0603]
C20FT  100n  C0603  [C0603]
C22FT1  100n  C0805  [C0805]
C23FT  100n  C0805  [C0805]
C26FT  33p  C0805  [C0805]
C27FT  33p  C0805  [C0805]
C36FT  100n  C0805  [C0805]
C36FT1  100n  C0805  [C0805]
IC6FT  LP2985AIM  [SOT23-5L]
IC7FT  AT93C46A-10SQ-2.7  [SOIC8]
IC9FT1  ADUM1201BR  ADUM1201  [SO08]
IC11FT  ADUM1201BR  ADUM1201  [SO08]
J3FT  USB-B  [USBCONNB]
L8FT  L0805  [R0805]
L9FT  L0805  [R0805]
L10FT  L0805  [R0805]
LED1  ARX  LEDSMT1206  [1206]
LED4  ATX  LEDSMT1206  [1206]
LED5  BRX  LEDSMT1206  [1206]
LED6  BTX  LEDSMT1206  [1206]
Q1FT  CRYSTALHC49S  [HC49/S]
R1FT  1k  R0805  [R0805]
R2FT  12k  R0805  [R0805]
R3FT  2k2  R0805  [R0805]
R4FT  10k  R0805  [R0805]
R5FT  10k  R0805  [R0805]
R6FT  10k  R0805  [R0805]
R7FT  0R  R0805  [R0805]
R15  1k  R0603  [R0603]
R81  1k  R0603  [R0603]
R83  1k  R0603  [R0603]
R84  1k  R0603  [R0603]
U$1FT  PGB1010603  [PGB1010603]
U$2FT  FT2232HL  [SQFP-S-10X10-64]
U$4FT  PGB1010603  [PGB1010603]

### Nets
ACTSFT: U$2FT.19(ADBUS3) ; also sheet 4
ADCD: U$2FT.23(ADBUS6) ; also sheet 4
ADSR: U$2FT.22(ADBUS5) ; also sheet 4
ADTR: U$2FT.21(ADBUS4) ; also sheet 4
ARI: U$2FT.24(ADBUS7) ; also sheet 4
ARTSFT: U$2FT.18(ADBUS2) ; also sheet 4
ARXFT: U$2FT.17(ADBUS1) ; also sheet 4
ATXFT: U$2FT.16(ADBUS0) ; also sheet 4
BCTSFT: IC9FT1.6(OB) U$2FT.41(BDBUS3)
BRTSFT: IC9FT1.7(IA) U$2FT.40(BDBUS2)
BRXFT: IC11FT.6(OB) U$2FT.39(BDBUS1)
BTXFT: IC11FT.7(IA) U$2FT.38(BDBUS0)
CTS: IC9FT1.2(OA) ; also sheet 1
GND: C22FT1.1 C23FT.1 IC9FT1.4(GND) IC11FT.4(GND) ; also sheet 1,2,3,4
N$1FT: J3FT.2 U$1FT.P$2 U$2FT.7(DM)
N$2FT: J3FT.3 U$2FT.8(DP) U$4FT.P$2
N$6FT: J3FT.4 J3FT.CASE@1(CASE) J3FT.CASE@2(CASE) R7FT.2
N$7: LED1.C U$2FT.29(ACBUS3)
N$8FT: R2FT.2 U$2FT.6(REF)
N$9FT: C8FT.2 IC6FT.1(VIN) IC6FT.3(ON/OFF) L9FT.2
N$10: R1FT.2 U$2FT.14(RESET#)
N$11: LED1.A R15.2
N$12FT: C9FT.2 IC6FT.4(BYPASS)
N$13: LED4.C U$2FT.30(ACBUS4)
N$14FT: C4FT.2 C5FT.+ L10FT.2 U$2FT.4(VPHY)
N$15FT: C2FT.2 C13FT.+ L8FT.2 U$2FT.9(VPLL)
N$16FT: IC7FT.1(CS) R6FT.1 U$2FT.63(EECS)
N$17FT: IC7FT.2(SK) R5FT.1 U$2FT.62(EECLK)
N$18: LED4.A R81.2
N$20: LED5.A R83.2
N$20FT: IC7FT.3(DI) R3FT.2 U$2FT.61(EEDATA)
N$21FT: IC7FT.4(DO) R3FT.1 R4FT.1
N$27: LED6.C U$2FT.55(BCBUS4)
N$28: LED6.A R84.2
N$29: LED5.C U$2FT.54(BCBUS3)
N$38FT: C26FT.2 Q1FT.2 U$2FT.3(OSCO)
N$43FT: C27FT.2 Q1FT.1 U$2FT.2(OSCI)
RTS: IC9FT1.3(IB) ; also sheet 1
RX: IC11FT.2(OA) ; also sheet 1
TX: IC11FT.3(IB) ; also sheet 1
USB1V8FT: C1FT.2 C12FT.2 C14FT.2 C15FT.2 U$2FT.12(VCORE) U$2FT.37(VCORE) U$2FT.49(VREGOUT) U$2FT.64(VCORE)
USB3V3FT: C10FT.2 C11FT.2 C16FT.2 C17FT.2 C18FT.2 C19FT.2 C20FT.2 C36FT1.2 C36FT.2 IC6FT.5(VOUT) IC7FT.6(ORG) IC7FT.8(VCC) IC9FT1.8(VCC2) IC11FT.8(VCC2) L8FT.1 L10FT.1 R1FT.1 R4FT.2 R5FT.2 R6FT.2 R15.1 R81.1 R83.1 R84.1 U$2FT.20(VCCIO) U$2FT.31(VCCIO) U$2FT.42(VCCIO) U$2FT.50(VREGIN) U$2FT.56(VCCIO)
USB5VFT: J3FT.1 L9FT.1 ; also sheet 2,4
USBGNDFT: C1FT.1 C2FT.1 C4FT.1 C5FT.- C8FT.1 C9FT.1 C10FT.1 C11FT.1 C12FT.1 C13FT.- C14FT.1 C15FT.1 C16FT.1 C17FT.1 C18FT.1 C19FT.1 C20FT.1 C26FT.1 C27FT.1 C36FT1.1 C36FT.1 IC6FT.2(GND) IC7FT.5(GND) IC7FT.7(NC) IC9FT1.5(GND2) IC11FT.5(GND2) R2FT.1 R7FT.1 U$1FT.P$1 U$2FT.1(GND) U$2FT.5(GND) U$2FT.10(AGND) U$2FT.11(GND) U$2FT.13(TEST) U$2FT.15(GND) U$2FT.25(GND) U$2FT.35(GND) U$2FT.47(GND) U$2FT.51(GND) U$4FT.P$1 ; supply symbol labelled 0V ; also sheet 2,4
VDD: C22FT1.2 C23FT.2 IC9FT1.1(VCC) IC11FT.1(VCC) ; also sheet 1,2,3
Unconnected: U$2FT.26(ACBUS0) U$2FT.27(ACBUS1) U$2FT.28(ACBUS2) U$2FT.32(ACBUS5) U$2FT.33(ACBUS6) U$2FT.34(ACBUS7) U$2FT.36(SUSPEND#) U$2FT.43(BDBUS4) U$2FT.44(BDBUS5) U$2FT.45(BDBUS6) U$2FT.46(BDBUS7) U$2FT.48(BCBUS0) U$2FT.52(BCBUS1) U$2FT.53(BCBUS2) U$2FT.57(BCBUS5) U$2FT.58(BCBUS6) U$2FT.59(BCBUS7) U$2FT.60(PWREN#)

### Notes on the sheet
- ISOLATED USB

## Power pins joined to a net without a drawn wire
ON/OFF: U$2.3(ON/OFF)

## Library data of the parts
C1-C5 C7 C10 C12 C13 C20 C21 C22FT1 C23FT C24 C26FT C27 C27FT C28 C36 C36FT C36FT1 C37-C41 C45 C50 C59 = NoiseRLC:C: Capacitor
C1FT C6 C9 C17-C19 = Zoli2:C: Capacitor
C2FT C4FT C8FT C9FT C10FT C11FT C12FT C14 C14FT C15 C15FT C16 C16FT C17FT C18FT C19FT C20FT C22 C23 C25 C26 C29-C35 C42-C44 C46 C51-C57 C63 C65 = Zoli:C: Capacitor
C5FT C8 C11 C13FT C47-C49 C58 C60-C62 C64 C66 C68 = rcl:CPOL-EU: POLARIZED CAPACITOR, European symbol
D1 = NoiseTR:D: Diode
F1 F2 = fuse:TE5: FUSE Wickmann
IC4 = NoiseIC:OPA_DUAL: Dual OP-Amp
IC5 IC6 = NoiseIC:ADG704: Analog MUX 4->1 single voltage
IC6FT = Zoli2:LP2985: Low dropout voltage regulator
IC7FT = Zoli2:AT93C46A-10?Q-2.7: Three-wire Automotive Temperature Serial EEPROM 1K (64 x 16) Source: http://www.atmel.com/dyn/resources/prod_documents/doc5089.pdf
IC8 = Zoli:R-78XX-0.5: VOLTAGE REGULATOR
IC9 = Zoli:MAX809: POWER SUPPLY MONITOR replacement for Maxim MAX809 and MAX810
IC9FT1 IC11FT = NoiseIC:ADUM1201: Digital isolator.
J2 = Zoli:DC_POWER_JACK: DC POWER JACK Source: DCJ0202.pdf
J3FT = Zoli:USB-B
JP1 JP4 = jumper:JP1E: JUMPER
JP2 = jumper:JP2E: JUMPER
L1 = Zoli:L: Inductance
L2-L5 = NoiseRLC:L: Inductance
L8FT L9FT L10FT = Zoli2:L: Inductance
LED1 LED3-LED6 = led:LED: LED OSRAM: - CHIPLED LG R971, LG N971, LY N971, LG Q971, LY Q971, LO R971, LY R971 LH N974, LH R974 LS Q976, LO Q976, LY Q976 LO Q996 - Hyper CHIPLED LW Q18S LB Q993, LB Q99A, LB R99A - SideLED LS A670, LO A670, LY A670, LG A670, LP A670 LB A673, LV A673, LT A673, LW A673 LH A674 LY A675 LS A676, LA A676, LO A676, LY A676, LW A676 LS A679, LY A679, LG A679 - Hyper Micro SIDELED® LS Y876, LA Y876, LO Y876, LY Y876 LT Y87S - SmartLED LW L88C, LW L88S LB L89C, LB L89S, LG L890 LS L89K, LO L89K, LY L89K LS L896, LA L896, LO L896, LY L896 - TOPLED LS T670, LO T670, LY T670, LG T670, LP T670 LSG T670, LSP T670, LSY T670, LOP T670, LYG T670 LG T671, LOG T671, LSG T671 LB T673, LV T673, LT T673, LW T673 LH T674 LS T676, LA T676, LO T676, LY T676, LB T676, LH T676, LSB T676, LW T676 LB T67C, LV T67C, LT T67C, LS T67K, LO T67K, LY T67K, LW E67C LS E67B, LA E67B, LO E67B, LY E67B, LB E67C, LV E67C, LT E67C LW T67C LS T679, LY T679, LG T679 LS T770, LO T770, LY T770, LG T770, LP T770 LB T773, LV T773, LT T773, LW T773 LH T774 LS E675, LA E675, LY E675, LS T675 LS T776, LA T776, LO T776, LY T776, LB T776 LHGB T686 LT T68C, LB T68C - Hyper Mini TOPLED® LB M676 - Mini TOPLED Santana® LG M470 LS M47K, LO M47K, LY M47K Source: http://www.osram.convergy.de LUXEON: - LUMILED® LXK2-PW12-R00, LXK2-PW12-S00, LXK2-PW14-U00, LXK2-PW14-V00 LXK2-PM12-R00, LXK2-PM12-S00, LXK2-PM14-U00 LXK2-PE12-Q00, LXK2-PE12-R00, LXK2-PE12-S00, LXK2-PE14-T00, LXK2-PE14-U00 LXK2-PB12-K00, LXK2-PB12-L00, LXK2-PB12-M00, LXK2-PB14-N00, LXK2-PB14-P00, LXK2-PB14-Q00 LXK2-PR12-L00, LXK2-PR12-M00, LXK2-PR14-Q00, LXK2-PR14-R00 LXK2-PD12-Q00, LXK2-PD12-R00, LXK2-PD12-S00 LXK2-PH12-R00, LXK2-PH12-S00 LXK2-PL12-P00, LXK2-PL12-Q00, LXK2-PL12-R00 Source: www.luxeon.com KINGBRIGHT: KA-3528ASYC Source: www.kingbright.com
Q1 = crystal:CRYTAL: CRYSTAL
Q1FT = crystal:CRYSTAL: CRYSTAL
R1 R3 R6 R8 R10 R11 R25-R31 R34 R35 R39-R70 = Zoli:R: Resistor
R1FT R2 R2FT R3FT R4 R4FT R5 R5FT R6FT R7 R7FT R9 R12 R13 R15 R16 R33 R37 R38 R81-R84 = NoiseRLC:R: Resistor
R14 R24 R71-R80 = Zoli2:R: Resistor
SV1 = Zoli2:ML10: HARTING
U1 = Zoli:C8051F060
U2 = Zoli:BS62LV4006
U3 = Zoli:LP2985
U4 = Zoli:REF192: VOLATAGE REFERENCE
U$1 = Zoli2:ADM211
U$1FT U$4FT = Zoli2:PGB1010603
U$2 = Zoli:TMR2D: Regulated DC/DC converter, dual output
U$2FT = Zoli2:FT2232HL
U$3 = Zoli2:SN65HVD230
U$4 = Zoli2:PAD_CONNECT_3
U$5 U$6 = NoiseIC:OPA_QUAD: Quad OP-Amp
X1 = con-subd:M37HP: SUB-D; OC_FARNELL: unknown; OC_NEWARK: unknown
X2 = con-subd:M09HP: SUB-D; OC_FARNELL: unknown; OC_NEWARK: unknown